# Altium project OSP_Carrier_V8.PrjPcb (part 2 of 2)

## Sheet OSP_Carrier_V8_SD.SchDoc: OSP_Carrier_V8
size B; ApprovedBy: HARI; Engineer: LP; Organization: THE_Lab; DocumentNumber: 1; Revision: 1; SheetNumber: 1; SheetTotal: 1
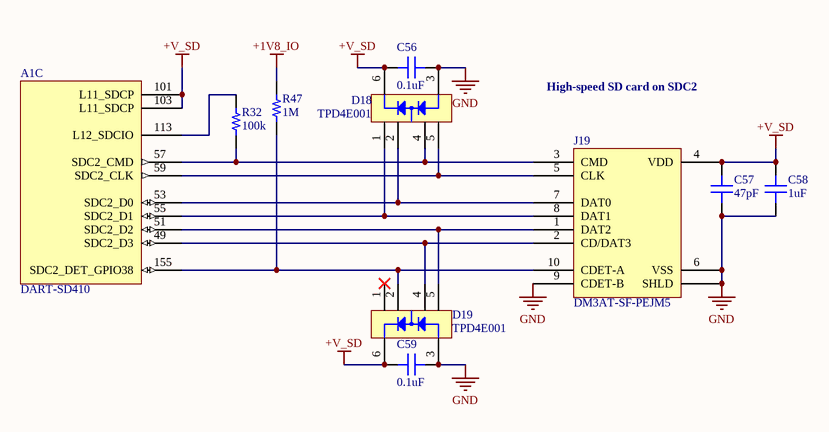
[diagram p5: OSP_Carrier_V8_SD.SchDoc]

### Parts
A1  DART-SD410  [DART-SD410]  (part C of 15)
C56  0.1uF  [CAP 0402/1005]
C57  47pF  [CAP 0402/1005]
C58  1uF  [CAP 0603/1608]
C59  0.1uF  [CAP 0402/1005]
D18  TPD4E001  [TI_SOT-563_DRL]
D19  TPD4E001  [TI_SOT-563_DRL]
J19  DM3AT-SF-PEJM5  [HIROSE DM3AT-SF-PEJM5]
R32  100k  [RES 0402/1005]
R47  1M  [RES 0402/1005]

### Nets
+1V8_IO: R47.2
+V_SD: A1.101(L11_SDCP) A1.103(L11_SDCP) C56.2 C57.2 C58.2 C59.2 D18.6 D19.6 J19.4(VDD)
GND: C56.1 C57.1 C58.1 C59.1 D18.3 D19.3 J19.6(VSS) J19.9(CDET-B) J19.S(SHLD)
NetA1_49: A1.49(SDC2_D3) D19.4 J19.2(CD/DAT3)
NetA1_51: A1.51(SDC2_D2) D19.5 J19.1(DAT2)
NetA1_53: A1.53(SDC2_D0) D18.2 J19.7(DAT0)
NetA1_55: A1.55(SDC2_D1) D18.1 J19.8(DAT1)
NetA1_57: A1.57(SDC2_CMD) D18.4 J19.3(CMD) R32.1
NetA1_59: A1.59(SDC2_CLK) D18.5 J19.5(CLK)
NetA1_113: A1.113(L12_SDCIO) R32.2
NetA1_155: A1.155(SDC2_DET_GPIO38) D19.2 J19.10(CDET-A) R47.1

Not connected (* = marked no-connect by the designer): D19 1*

### Notes on the sheet
- High-speed SD card on SDC2
- Title
- Size:
- Date:
- B
- Revision:
- Time:
- Engineer:
- Approved:
- Sheet
- of
- THE_Lab
- Atkinson Hall, 5202
- UC San Diego
- 9500 Gilman Drive #0436
- La Jolla, CA 92093-0436
- File:

### Library data of the parts
A1 = DART-SD410: Variscite DART-SD410 System on Module
C56 C59 = C1005X7R1H104K050BB: CAP CER 0.1UF 50V X7R 0402; Manufacturer: TDK Corporation; TemperatureRange: -55C ~ 125C; Tolerance: 10%; Value: 0.1uF; Part Number: C1005X7R1H104K050BB; PartId: 3860; Supplier 1: Digi-Key; Supplier Part Number 1: 445-5932-2-ND; ComponentLink1Description: Datasheet; ComponentLink1URL: https://product.tdk.com/info/en/catalog/datasheets/mlcc_commercial_general_en.pdf; ComponentLink2Description: Digi-Key listing; ComponentLink2URL: http://digikey.com/product-detail/en/C1005X7R1H104K050BB/445-5932-2-ND/2443410; TemperatureCoefficient: X7R; Voltage: 50V; Price: 0.0287; Type: -; Device Package: 0402 (1005 Metric)
C57 = C1005C0G1H470G050BA: CAP CER 47PF 50V C0G 0402; Manufacturer: TDK Corporation; TemperatureRange: -55C ~ 125C; TemperatureCoefficient: C0G, NP0; Tolerance: 2%; Value: 47pF; Part Number: C1005C0G1H470G050BA; PartId: 3864; Supplier 1: Digi-Key; Supplier Part Number 1: 445-5364-2-ND; ComponentLink1Description: Datasheet; ComponentLink1URL: https://product.tdk.com/info/en/catalog/datasheets/mlcc_commercial_general_en.pdf; ComponentLink2Description: Digi-Key listing; ComponentLink2URL: http://digikey.com/product-detail/en/C1005C0G1H470G050BA/445-5364-2-ND/2269858; Voltage: 50V; Price: 0.1148; Type: -; Device Package: 0402 (1005 Metric)
C58 = C1608X7R1E105K080AB: CAP CER 1UF 25V X7R 0603; Manufacturer: TDK Corporation; TemperatureRange: -55C ~ 125C; Tolerance: 10%; Value: 1uF; Part Number: C1608X7R1E105K080AB; PartId: 4041; Supplier 1: Digi-Key; Supplier Part Number 1: 445-5956-1-ND; ComponentLink1Description: Datasheet; ComponentLink1URL: https://product.tdk.com/info/en/catalog/datasheets/mlcc_commercial_general_en.pdf; ComponentLink2Description: Digi-Key listing; ComponentLink2URL: http://digikey.com/product-detail/en/C1608X7R1E105K080AB/445-5956-1-ND/2443997; TemperatureCoefficient: X7R; Voltage: 25V; Price: 0.27; Type: -; Device Package: 0603 (1608 Metric)
D18 D19 = TI_TPD4E001: TI TPD4E001 4-channel TVS ESD protection diodes
J19 = DM3AT-SF-PEJM5: CONN MICRO SD CARD PUSH-PUSH R/A; Manufacturer: Hirose Electric Co Ltd; Number of Positions: 10 (8 + 2); Connector Type: Connector and Ejector; Part Number: DM3AT-SF-PEJM5; PartId: 9287; Supplier 1: Digi-Key; Supplier Part Number 1: HR1964TR-ND; ComponentLink1Description: Datasheet; ComponentLink1URL: http://www.hirose.co.jp/cataloge_hp/e60900232.pdf; ComponentLink2Description: Digi-Key Listing; ComponentLink2URL: http://www.digikey.ca/product-detail/en/DM3AT-SF-PEJM5/HR1964TR-ND/2533565; Price: 2.1114; Type: Connector and Ejector; Mounting Type: Surface Mount, Right Angle; Features: Switch; Contact Finish: Gold
R32 = ERJ-2RKF1003X: RES SMD 100K OHM 1% 1/10W 0402; Value: 1K; Part Number: ERJ-2RKF1003X
R47 = ERJ-2RKF1004X: RES SMD 1M OHM 1% 1/10W 0402; Manufacturer: Panasonic Electronic Components; TemperatureRange: -55C ~ 155C; TemperatureCoefficient: 100ppm/C; PowerRating: 0.1W, 1/10W; Value: 1M; Part Number: ERJ-2RKF1004X; PartId: 7; Supplier 1: Digi-Key; Supplier Part Number 1: P1.00MLTR-ND; ComponentLink1Description: Datasheet; ComponentLink1URL: http://industrial.panasonic.com/www-cgi/jvcr13pz.cgi?E+PZ+3+AOA0002+ERJ2RKF1004X+7+WW; ComponentLink2Description: Digikey listing; ComponentLink2URL: http://digikey.com/product-detail/en/ERJ-2RKF1004X/P1.00MLTR-ND/79728; Tolerance: 1%; Price: 0.0043; Type: Thick Film; Device Package: 0402 (1005 Metric)

## Sheet OSP_Carrier_V8_FM-ExG.SchDoc: OSP_Carrier_V8
size B; ApprovedBy: HARI; Engineer: LP; Organization: THE_Lab; DocumentNumber: 1; Revision: 1; SheetNumber: 1; SheetTotal: 1
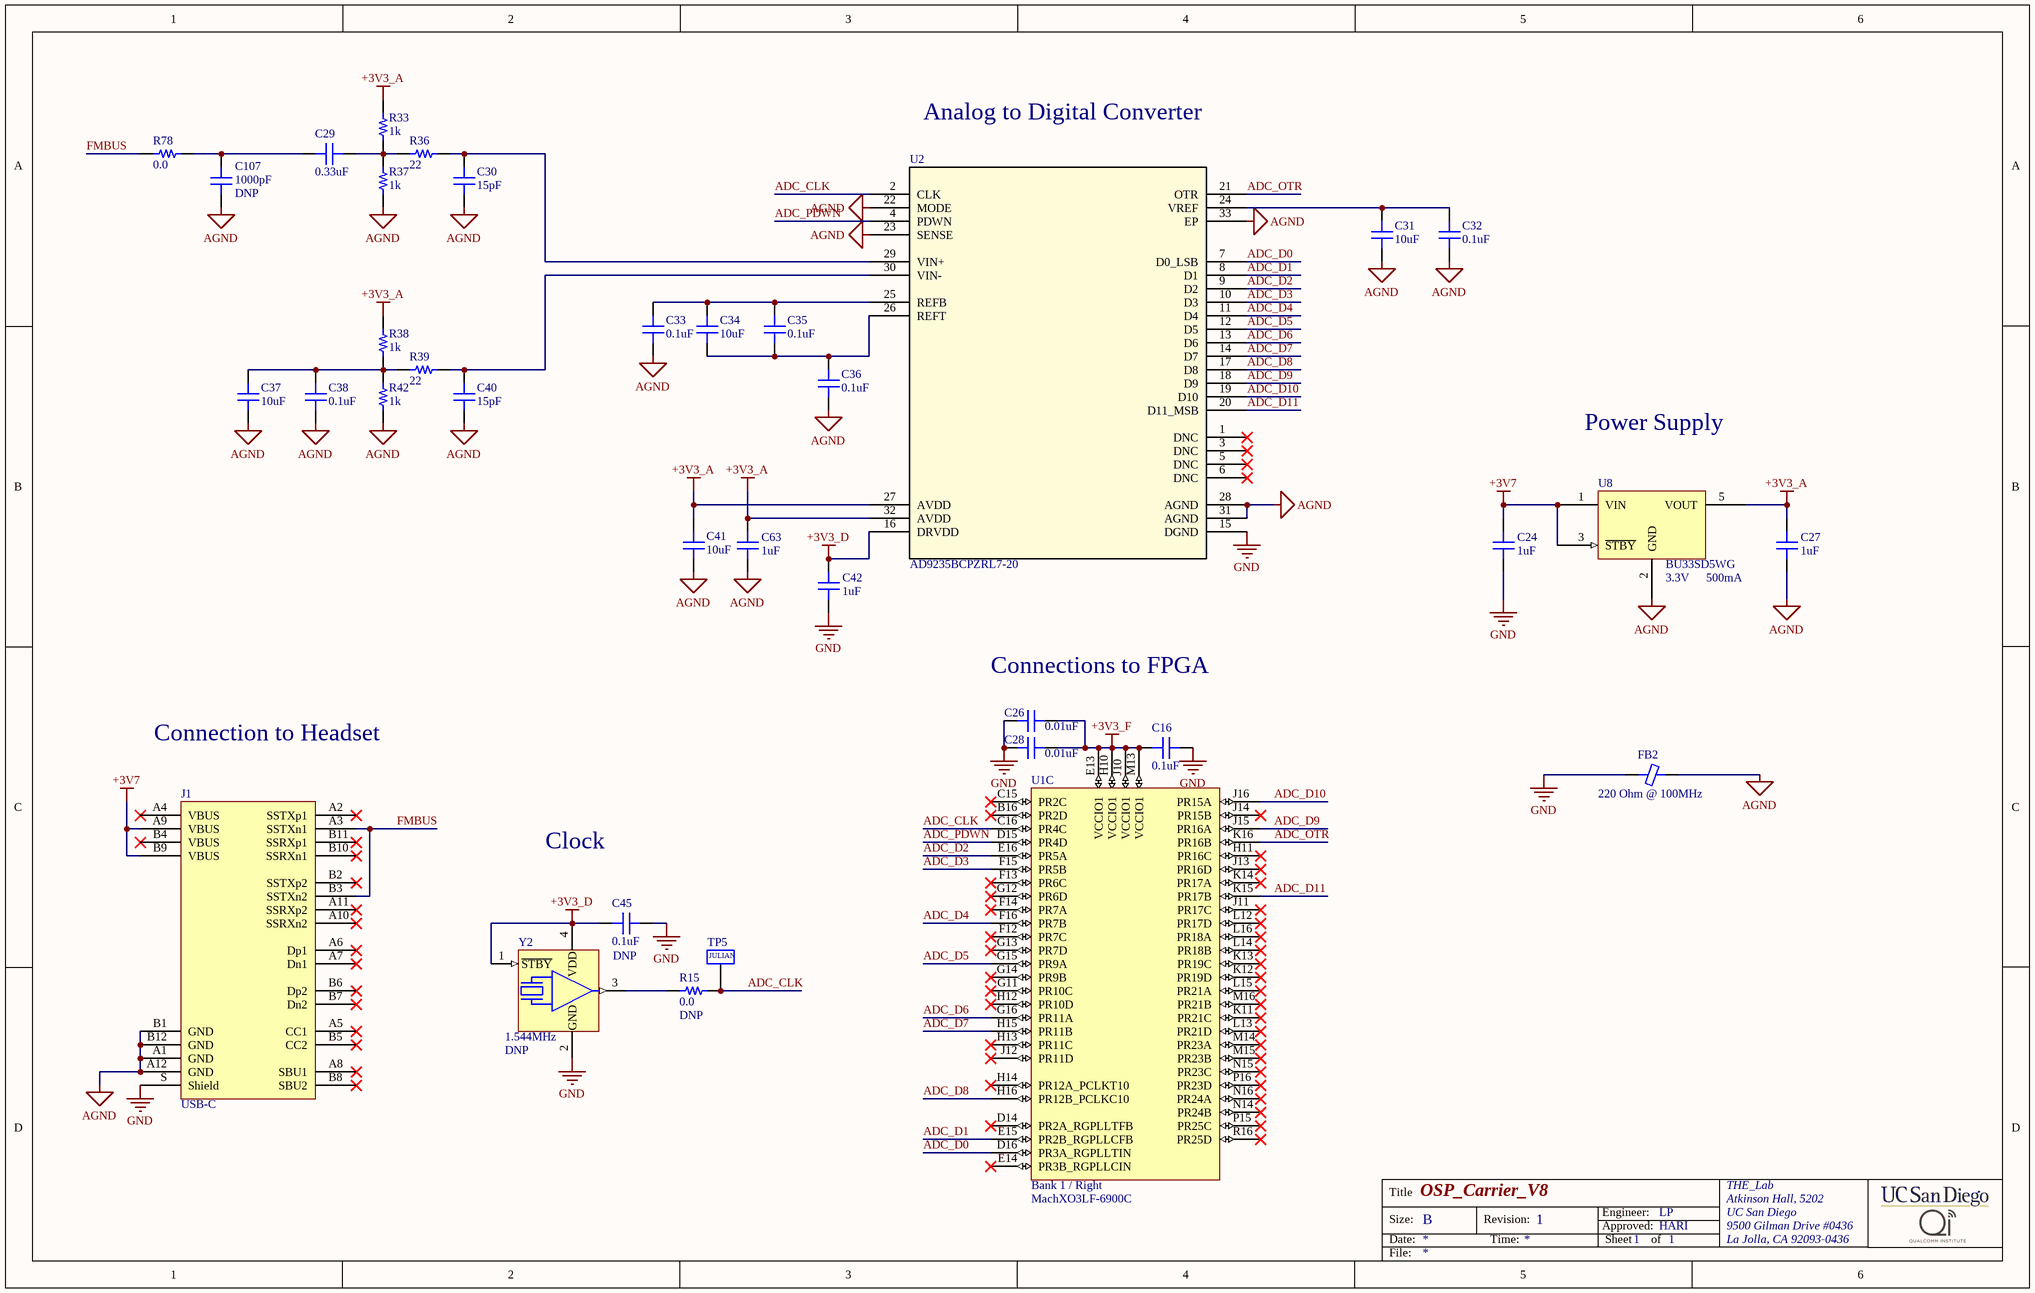
[diagram p6: OSP_Carrier_V8_FM-ExG.SchDoc]

### Parts
C16  0.1uF  [CAP 0402/1005]
C24  1uF  [CAP 0402/1005]
C26  0.01uF  [CAP 0402/1005]
C27  1uF  [CAP 0402/1005]
C28  0.01uF  [CAP 0402/1005]
C29  0.33uF  [CAP 0402/1005]
C30  15pF  [CAP 0402/1005]
C31  10uF  [CAP 0805/2012]
C32  0.1uF  [CAP 0402/1005]
C33  0.1uF  [CAP 0402/1005]
C34  10uF  [CAP 0805/2012]
C35  0.1uF  [CAP 0402/1005]
C36  0.1uF  [CAP 0402/1005]
C37  10uF  [CAP 0805/2012]
C38  0.1uF  [CAP 0402/1005]
C40  15pF  [CAP 0402/1005]
C41  10uF  [CAP 0805/2012]
C42  1uF  [CAP 0402/1005]
C45  0.1uF  [CAP 0402/1005]
C63  1uF  [CAP 0402/1005]
C107  1000pF  [CAP 0805/2012]
FB2  220 Ohm @ 100MHz  [FER 0402/1005]
J1  USB-C  [TE_USB-C_2129691-1]
R15  0.0  [RES 0603/1608]
R33  1k  [RES 0402/1005]
R36  22  [RES 0402/1005]
R37  1k  [RES 0402/1005]
R38  1k  [RES 0402/1005]
R39  22  [RES 0402/1005]
R42  1k  [RES 0402/1005]
R78  0.0  [RES 0805/2012]
TP5  TP_SMD_JULIAN  [TP_SMD_JULIAN]  (value not drawn)
U1  MachXO3LF-6900C  [LCMXO3_caBGA_BG256]  (part C of 7)
U2  AD9235BCPZRL7-20  [CP_32_2-M]
U8  BU33SD5WG  VOLTAGE: 3.3V  CURRENT: 500mA  [ROHM_SSOP5]
Y2  1.544MHz  [ABRACON_ASFLMB]

### Nets
+3V3_A: C27.1 C41.2 C63.1 R33.2 R38.2 U2.27(AVDD) U2.32(AVDD) U8.5(VOUT)
+3V3_D: C42.1 C45.2 U2.16(DRVDD) Y2.1(~{STBY}) Y2.4(VDD)
+3V3_F: C16.2 C26.1 C28.1 U1.E13(VCCIO1) U1.H10(VCCIO1) U1.J10(VCCIO1) U1.M13(VCCIO1)
+3V7: C24.1 J1.A9(VBUS) J1.B9(VBUS) U8.1(VIN) U8.3(~{STBY})
AGND: C27.2 C30.1 C31.1 C32.2 C33.2 C36.2 C37.1 C38.2 C40.1 C41.1 C63.2 C107.1 FB2.2 J1.A1(GND) J1.A12(GND) J1.B1(GND) J1.B12(GND) R37.1 R42.1 U2.22(MODE) U2.23(SENSE) U2.28(AGND) U2.31(AGND) U2.33(EP) U8.2(GND)
GND: C16.1 C24.2 C26.2 C28.2 C42.2 C45.1 FB2.1 J1.S(Shield) U2.15(DGND) Y2.2(GND)
ADC_CLK: R15.1 TP5.1 U1.C16(PR4C) U2.2(CLK)
ADC_D0: U1.D16(PR3A_RGPLLTIN) U2.7(D0_LSB)
ADC_D1: U1.E15(PR2B_RGPLLCFB) U2.8(D1)
ADC_D2: U1.E16(PR5A) U2.9(D2)
ADC_D3: U1.F15(PR5B) U2.10(D3)
ADC_D4: U1.F16(PR7B) U2.11(D4)
ADC_D5: U1.G15(PR9A) U2.12(D5)
ADC_D6: U1.G16(PR11A) U2.13(D6)
ADC_D7: U1.H15(PR11B) U2.14(D7)
ADC_D8: U1.H16(PR12B_PCLKC10) U2.17(D8)
ADC_D9: U1.J15(PR16A) U2.18(D9)
ADC_D10: U1.J16(PR15A) U2.19(D10)
ADC_D11: U1.K15(PR17B) U2.20(D11_MSB)
ADC_OTR: U1.K16(PR16B) U2.21(OTR)
ADC_PDWN: U1.D15(PR4D) U2.4(PDWN)
FMBUS: J1.A3(SSTXn1) J1.B3(SSTXn2) R78.1
NetC29_1: C29.1 C107.2 R78.2
NetC29_2: C29.2 R33.1 R36.1 R37.2
NetC30_2: C30.2 R36.2 U2.29(VIN+)
NetC31_2: C31.2 C32.1 U2.24(VREF)
NetC33_1: C33.1 C34.2 C35.1 U2.25(REFB)
NetC34_1: C34.1 C35.2 C36.1 U2.26(REFT)
NetC37_2: C37.2 C38.1 R38.1 R39.1 R42.2
NetC40_2: C40.2 R39.2 U2.30(VIN-)
NetR15_2: R15.2 Y2.3(OUT)

Not connected (* = marked no-connect by the designer): J1 A2(SSTXp1)* A4(VBUS)* A5(CC1)* A6(Dp1)* A7(Dn1)* A8(SBU1)* A10(SSRXn2)* A11(SSRXp2)* B2(SSTXp2)* B4(VBUS)* B5(CC2)* B6(Dp2)* B7(Dn2)* B8(SBU2)* B10(SSRXn1)* B11(SSRXp1)*; U1 B16(PR2D)* C15(PR2C)* D14(PR2A_RGPLLTFB)* E14(PR3B_RGPLLCIN)* F12(PR7C)* F13(PR6C)* F14(PR7A)* G11(PR10C)* G12(PR6D)* G13(PR7D)* G14(PR9B)* H11(PR16C)* H12(PR10D)* H13(PR11C)* H14(PR12A_PCLKT10)* J11(PR17C)* J12(PR11D)* J13(PR16D)* J14(PR15B)* K11(PR21C)* K12(PR19D)* K13(PR19C)* K14(PR17A)* L12(PR17D)* L13(PR21D)* L14(PR18B)* L15(PR21A)* L16(PR18A)* M14(PR23A)* M15(PR23B)* M16(PR21B)* N14(PR24B)* N15(PR23C)* N16(PR24A)* P15(PR25C)* P16(PR23D)* R16(PR25D)*; U2 1(DNC)* 3(DNC)* 5(DNC)* 6(DNC)*

### Notes on the sheet
- Analog to Digital Converter
- Power Supply
- (near C26) Connections to FPGA
- Connection to Headset
- Clock
- Title
- Size:
- Date:
- B
- Revision:
- Time:
- Engineer:
- Approved:
- Sheet
- of
- THE_Lab
- Atkinson Hall, 5202
- UC San Diego
- 9500 Gilman Drive #0436
- La Jolla, CA 92093-0436
- File:
- (in symbol LCMXO3LF-6900C-XBG256X, part C) Bank 1 / Right
- (in symbol TP_SMD_JULIAN) JULIAN

### Library data of the parts
C16 C32 C33 C35 C36 C38 C45 = C1005X7R1H104K050BB: as C56 on sheet OSP_Carrier_V8_SD; Value: 0.1uF; Part Number: C1005X7R1H104K050BB; PartId: 3860; Supplier 1: Digi-Key; Supplier Part Number 1: 445-5932-2-ND; ComponentLink1Description: Datasheet; ComponentLink1URL: https://product.tdk.com/info/en/catalog/datasheets/mlcc_commercial_general_en.pdf; ComponentLink2Description: Digi-Key listing; ComponentLink2URL: http://digikey.com/product-detail/en/C1005X7R1H104K050BB/445-5932-2-ND/2443410; TemperatureCoefficient: X7R; Voltage: 50V; Price: 0.0287; Type: -; Device Package: 0402 (1005 Metric)
  C45: DNP: DNP
C24 C27 C29 C42 C63 = GRM155R61A105KE15D: CAP CER 1UF 10V X5R 0402; Manufacturer: Murata Electronics North America; TemperatureRange: -55C ~ 85C; Tolerance: 10%; Part Number: GRM155R61A105KE15D; PartId: 12338; Supplier 1: Digi-Key; Supplier Part Number 1: 490-3890-2-ND; ComponentLink1Description: Datasheet; ComponentLink1URL: http://www.murata.com/~/media/webrenewal/support/library/catalog/products/capacitor/mlcc/c02e.pdf; ComponentLink2Description: Digi-Key Listing; ComponentLink2URL: https://www.digikey.com/product-detail/en/murata-electronics-north-america/GRM155R61A105KE15D/490-3890-2-ND/965904; TemperatureCoefficient: X5R; Voltage: 10V; Price: 0.0069; Device Package: 0402 (1005 Metric)
  C24 C27 C42 C63: Value: 1uF
  C29: Value: 0.33uF
C26 C28 = CC0402KRX7R8BB103: CAP CER 10000PF 25V X7R 0402; Manufacturer: Yageo; TemperatureRange: -55C ~ 125C; Tolerance: 10%; Value: 0.01uF; Part Number: CC0402KRX7R8BB103; PartId: 12361; Supplier 1: Digi-Key; Supplier Part Number 1: 311-1337-2-ND; ComponentLink1Description: Datasheet; ComponentLink1URL: http://www.yageo.com/documents/recent/UPY-GPHC_X7R_6.3V-to-50V_13.pdf; ComponentLink2Description: Digi-Key Listing; ComponentLink2URL: https://www.digikey.com/product-detail/en/yageo/CC0402KRX7R8BB103/311-1337-2-ND/2103075; TemperatureCoefficient: X7R; Voltage: 25V; Price: 0.0017; Device Package: 0402 (1005 Metric)
C30 C40 = C1005C0G1H150F050BA: CAP CER 15PF 50V C0G 0402; Manufacturer: TDK Corporation; TemperatureRange: -55C ~ 125C; TemperatureCoefficient: C0G, NP0; Tolerance: 1%; Value: 15pF; Part Number: C1005C0G1H150F050BA; PartId: 3865; Supplier 1: Digi-Key; Supplier Part Number 1: 445-7007-2-ND; ComponentLink1Description: Datasheet; ComponentLink1URL: https://product.tdk.com/info/en/catalog/datasheets/mlcc_commercial_general_en.pdf; ComponentLink2Description: Digi-Key listing; ComponentLink2URL: http://digikey.com/product-detail/en/C1005C0G1H150F050BA/445-7007-2-ND/2674809; Voltage: 50V; Price: 0.1262; Type: -; Device Package: 0402 (1005 Metric)
C31 C34 C37 C41 = C2012X5R1A106M125AB: CAP CER 10UF 10V X5R 0805; Manufacturer: TDK Corporation; TemperatureRange: -55C ~ 85C; Tolerance: 20%; Value: 10uF; Part Number: C2012X5R1A106M125AB; PartId: 4520; Supplier 1: Digi-Key; Supplier Part Number 1: 445-7661-2-ND; ComponentLink1Description: Datasheet; ComponentLink1URL: https://product.tdk.com/info/en/catalog/datasheets/mlcc_commercial_general_en.pdf; ComponentLink2Description: Digi-Key listing; ComponentLink2URL: http://digikey.com/product-detail/en/C2012X5R1A106M125AB/445-7661-2-ND/2733096; TemperatureCoefficient: X5R; Voltage: 10V; Price: 0.0521; Type: -; Device Package: 0805 (2012 Metric)
C107 = C2012C0G1H102J060AA: CAP CER 1000PF 50V C0G 0805; Manufacturer: TDK Corporation; TemperatureRange: -55C ~ 125C; TemperatureCoefficient: C0G, NP0; Tolerance: 5%; Value: 1000pF; Part Number: C2012C0G1H102J060AA; PartId: 4403; Supplier 1: Digi-Key; Supplier Part Number 1: 445-1330-2-ND; ComponentLink1Description: Datasheet; ComponentLink1URL: https://product.tdk.com/info/en/catalog/datasheets/mlcc_commercial_general_en.pdf; ComponentLink2Description: Digi-Key listing; ComponentLink2URL: http://digikey.com/product-detail/en/C2012C0G1H102J060AA/445-1330-2-ND/513853; Voltage: 50V; Price: 0.0253; Type: -; Device Package: 0805 (2012 Metric); DNP: DNP
FB2 = CIM05U221NC: FERRITE CHIP 220 OHM 500MA 0402; Manufacturer: Samsung Electro-Mechanics America, Inc.; Type: Differential Mode - Single; DC Resistance: 350 mOhm Max; Part Number: CIM05U221NC; PartId: 6444; Value: 220 Ohm @ 100MHz; Supplier 1: Digi-Key; Supplier Part Number 1: 1276-6344-2-ND; ComponentLink1Description: Datasheet; ComponentLink1URL: http://www.samsungsem.com/kr/front/downloadcms.do?path=/kr/support/product-search/bead/__icsFiles/afieldfile/2014/11/13&fileName=S_CIM05J102NC.pdf; ComponentLink2Description: Digi-Key listing; ComponentLink2URL: http://digikey.com/product-detail/en/CIM05U221NC/1276-6344-2-ND/3973776; Price: 0.0073; Device Package: 0402 (1005 Metric); Current Rating: 500mA
J1 = TE_USB_C_2129691-1: TE 2129691-1 USB-C Socket
R15 = CRCW06030000Z0EAHP: RES SMD 0.0 OHM JUMPER 1/4W 0603; Manufacturer: Vishay Dale; TemperatureRange: -55C ~ 155C; PowerRating: 0.25W, 1/4W; Value: 0.0; Part Number: CRCW06030000Z0EAHP; PartId: 16113; Supplier 1: Digi-Key; Supplier Part Number 1: 541-0.0SBTR-ND; ComponentLink1Description: Datasheet; ComponentLink1URL: http://www.vishay.com/docs/20043/crcwhpe3.pdf; ComponentLink2Description: Digi-Key Listing; ComponentLink2URL: https://www.digikey.com/product-detail/en/vishay-dale/CRCW06030000Z0EAHP/541-0.0SBTR-ND/2222231; Tolerance: Jumper; Price: 0.0238; Device Package: 0603 (1608 Metric); DNP: DNP
R33 R37 R38 R42 = ERJ-2RKF1001X: RES SMD 1K OHM 1% 1/10W 0402; Manufacturer: Panasonic Electronic Components; TemperatureRange: -55C ~ 155C; TemperatureCoefficient: 100ppm/C; PowerRating: 0.1W, 1/10W; Value: 1k; Part Number: ERJ-2RKF1001X; PartId: 4; Supplier 1: Digi-Key; Supplier Part Number 1: P1.00KLTR-ND; ComponentLink1Description: Datasheet; ComponentLink1URL: http://industrial.panasonic.com/www-cgi/jvcr13pz.cgi?E+PZ+3+AOA0002+ERJ2RKF1001X+7+WW; ComponentLink2Description: Digikey listing; ComponentLink2URL: http://digikey.com/product-detail/en/ERJ-2RKF1001X/P1.00KLTR-ND/79729; Tolerance: 1%; Price: 0.0043; Type: Thick Film; Device Package: 0402 (1005 Metric)
R36 R39 = ERJ-2RKF22R0X: RES SMD 22 OHM 1% 1/10W 0402; Manufacturer: Panasonic Electronic Components; TemperatureRange: -55C ~ 155C; TemperatureCoefficient: 100ppm/C; PowerRating: 0.1W, 1/10W; Value: 22; Part Number: ERJ-2RKF22R0X; PartId: 12215; Supplier 1: Digi-Key; Supplier Part Number 1: P22.0LTR-ND; ComponentLink1Description: Datasheet; ComponentLink1URL: http://industrial.panasonic.com/www-cgi/jvcr13pz.cgi?E+PZ+3+AOA0002+ERJ2RKF22R0X+7+WW; ComponentLink2Description: Digi-Key Listing; ComponentLink2URL: https://www.digikey.com/product-detail/en/panasonic-electronic-components/ERJ-2RKF22R0X/P22.0LTR-ND/1746157; Tolerance: 1%; Price: 0.0028; Device Package: 0402 (1005 Metric)
R78 = CRCW08050000Z0EAHP: RES SMD 0.0 OHM JUMPER 1/2W 0805; Manufacturer: Vishay Dale; TemperatureRange: -55C ~ 155C; PowerRating: 0.5W, 1/2W; Value: 0.0; Part Number: CRCW08050000Z0EAHP; PartId: 16147; Supplier 1: Digi-Key; Supplier Part Number 1: 541-0.0TBTR-ND; ComponentLink1Description: Datasheet; ComponentLink1URL: http://www.vishay.com/docs/20043/crcwhpe3.pdf; ComponentLink2Description: Digi-Key Listing; ComponentLink2URL: https://www.digikey.com/product-detail/en/vishay-dale/CRCW08050000Z0EAHP/541-0.0TBTR-ND/2222316; Tolerance: Jumper; Price: 0.0356; Device Package: 0805 (2012 Metric)
TP5 = TP_SMD_JULIAN: Julian Extra-Large SMD Test Point; DNP: DNP
U1 = LCMXO3LF-6900C-XBG256X: Lattice MachXO3LF-6900C-5BG256C FPGA
U2 = AD9235BCPZRL7-20: Imported; Manufacturer_Part_Number: AD9235BCPZRL7-20; Vendor: Vendor; Value: Value; Type: Type; RefDes: Refdes
U8 = ROHM_BU33SD5WG: ROHM BU33SD5WG-TR 3.3V 500mA LDO
Y2 = ABRA_ASFLMB-1.544MHZ-LR-T: Abracon ASFLMB-1.544MHZ-LR-T; DIGIKEY_PN: 535-11006-1-ND; DNP: DNP

## Nets that join several sheets
+1V8_IO: OSP_Carrier_V8_Power (C62.1 U7.3), OSP_Carrier_V8_DJB (7 pins), OSP_Carrier_V8_Misc (7 pins), OSP_Carrier_V8_SD (R47.2)
+3V3_D: OSP_Carrier_V8_Power (6 pins), OSP_Carrier_V8_DJB (R12.2 R18.2), OSP_Carrier_V8_FM-ExG (5 pins)
+3V3_F: OSP_Carrier_V8_Power (17 pins), OSP_Carrier_V8_DJB (22 pins), OSP_Carrier_V8_FM-ExG (7 pins)
+3V7: OSP_Carrier_V8_Power (15 pins), OSP_Carrier_V8_DJB (J2.A4 J2.B4 J3.A4 J3.B4), OSP_Carrier_V8_PMIC_Audio (C43.1 R6.2 U3.1), OSP_Carrier_V8_Misc (6 pins), OSP_Carrier_V8_FM-ExG (5 pins)
+5V_USB: OSP_Carrier_V8_Power (D2.1), OSP_Carrier_V8_USB (D1.6 J4.1 R30.2)
GND: OSP_Carrier_V8_Power (81 pins), OSP_Carrier_V8_DJB (27 pins), OSP_Carrier_V8_USB (17 pins), OSP_Carrier_V8_PMIC_Audio (C43.2 FB4.2), OSP_Carrier_V8_Misc (13 pins), OSP_Carrier_V8_SD (9 pins), OSP_Carrier_V8_FM-ExG (10 pins)
GPIO7: OSP_Carrier_V8_DJB (U1.R5), OSP_Carrier_V8_USB (A1.79)
GPIO17: OSP_Carrier_V8_DJB (Q7.1), OSP_Carrier_V8_Misc (A1.69)
GPIO31_CLK: OSP_Carrier_V8_DJB (U1.T15), OSP_Carrier_V8_Misc (A1.185)
GPIO62_INT: OSP_Carrier_V8_DJB (U1.T6), OSP_Carrier_V8_Misc (A1.160)
MUTE_LED: OSP_Carrier_V8_DJB (U1.F1), OSP_Carrier_V8_Misc (Q4.1)
SPI1_CS2: OSP_Carrier_V8_DJB (U1.T5), OSP_Carrier_V8_Misc (A1.65)
SPI3_CLK: OSP_Carrier_V8_DJB (A1.74 U1.R10), OSP_Carrier_V8_Misc (U4.13)
SPI3_CS3: OSP_Carrier_V8_DJB (U1.R6), OSP_Carrier_V8_Misc (A1.152)
SPI3_MISO: OSP_Carrier_V8_DJB (A1.72 U1.T9), OSP_Carrier_V8_Misc (U4.1)
SPI3_MOSI: OSP_Carrier_V8_DJB (A1.76 U1.T10), OSP_Carrier_V8_Misc (U4.14)
SW_VOL+: OSP_Carrier_V8_DJB (U1.P13), OSP_Carrier_V8_Misc (A1.162 R44.1 SW1.1)